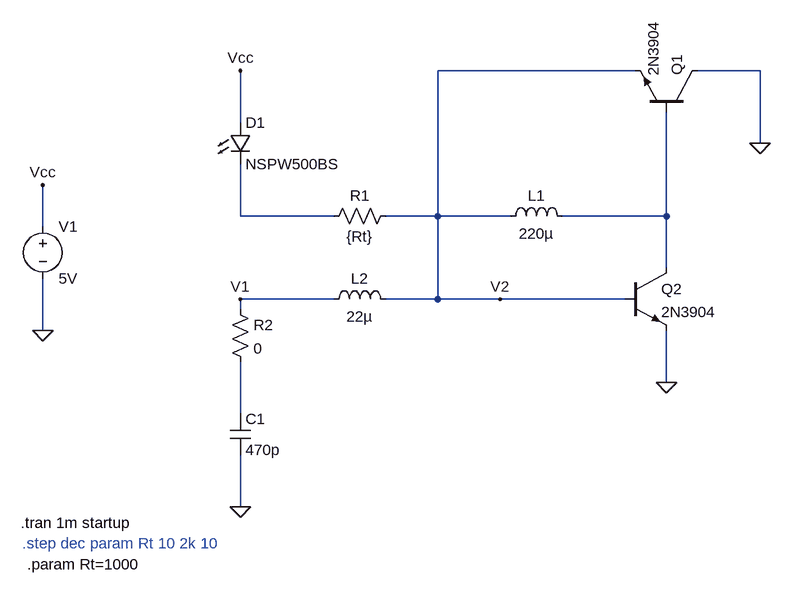
[diagram p0: schematic minati_fig-6.asc]
minati_fig-6.asc, the LTspice schematic file:
Version 4
SHEET 1 880 680
WIRE 368 -160 64 -160
WIRE 560 -160 464 -160
WIRE -240 -80 -240 -160
WIRE 560 -48 560 -160
WIRE -240 64 -240 -16
WIRE -96 64 -240 64
WIRE 64 64 64 -160
WIRE 64 64 -16 64
WIRE 176 64 64 64
WIRE 416 64 416 -96
WIRE 416 64 256 64
WIRE -544 80 -544 16
WIRE 416 144 416 64
WIRE -96 192 -240 192
WIRE 64 192 64 64
WIRE 64 192 -16 192
WIRE 160 192 64 192
WIRE 352 192 160 192
WIRE -240 208 -240 192
WIRE -544 240 -544 160
WIRE 416 320 416 240
WIRE -240 368 -240 288
WIRE -240 512 -240 432
FLAG -544 16 Vcc
FLAG -544 240 0
FLAG 416 320 0
FLAG -240 -160 Vcc
FLAG -240 512 0
FLAG 560 -48 0
FLAG -240 192 V1
FLAG 160 192 V2
SYMBOL ind 160 80 R270
WINDOW 0 32 56 VTop 2
WINDOW 3 5 56 VBottom 2
SYMATTR InstName L1
SYMATTR Value 220µ
SYMBOL ind -112 208 R270
WINDOW 0 32 56 VTop 2
WINDOW 3 5 56 VBottom 2
SYMATTR InstName L2
SYMATTR Value 22µ
SYMBOL res 0 48 R90
WINDOW 0 0 56 VBottom 2
WINDOW 3 32 56 VTop 2
SYMATTR InstName R1
SYMATTR Value {Rt}
SYMBOL voltage -544 64 R0
WINDOW 123 0 0 Left 0
WINDOW 39 0 0 Left 0
SYMATTR InstName V1
SYMATTR Value 5V
SYMBOL npn 464 -96 M270
SYMATTR InstName Q1
SYMATTR Value 2N3904
SYMBOL npn 352 144 R0
SYMATTR InstName Q2
SYMATTR Value 2N3904
SYMBOL cap -256 368 R0
SYMATTR InstName C1
SYMATTR Value 470p
SYMBOL LED -256 -80 R0
SYMATTR InstName D1
SYMATTR Value NSPW500BS
SYMATTR Description Diode
SYMATTR Type diode
SYMBOL res -256 192 R0
SYMATTR InstName R2
SYMATTR Value 0
TEXT -578 536 Left 2 !.tran 1m startup
TEXT -576 568 Left 2 ;.step dec param Rt 10 2k 10
TEXT -568 600 Left 2 !.param Rt=1000

The netlist it stands for:
* minati_fig-6.asc
L1 V2 N002 220µ
L2 V1 V2 22µ
R1 V2 N001 {Rt}
V1 Vcc 0 5V
Q1 0 N002 V2 0 2N3904
Q2 N002 V2 0 0 2N3904
C1 N003 0 470p
D1 Vcc N001 NSPW500BS
R2 V1 N003 0
.model D D
.lib standard.dio
.model NPN NPN
.model PNP PNP
.lib standard.bjt
.tran 1m startup
* .step dec param Rt 10 2k 10
.param Rt=1000
.backanno
.end